# EAGLE design motor_controller (EAGLE 6.5.0)
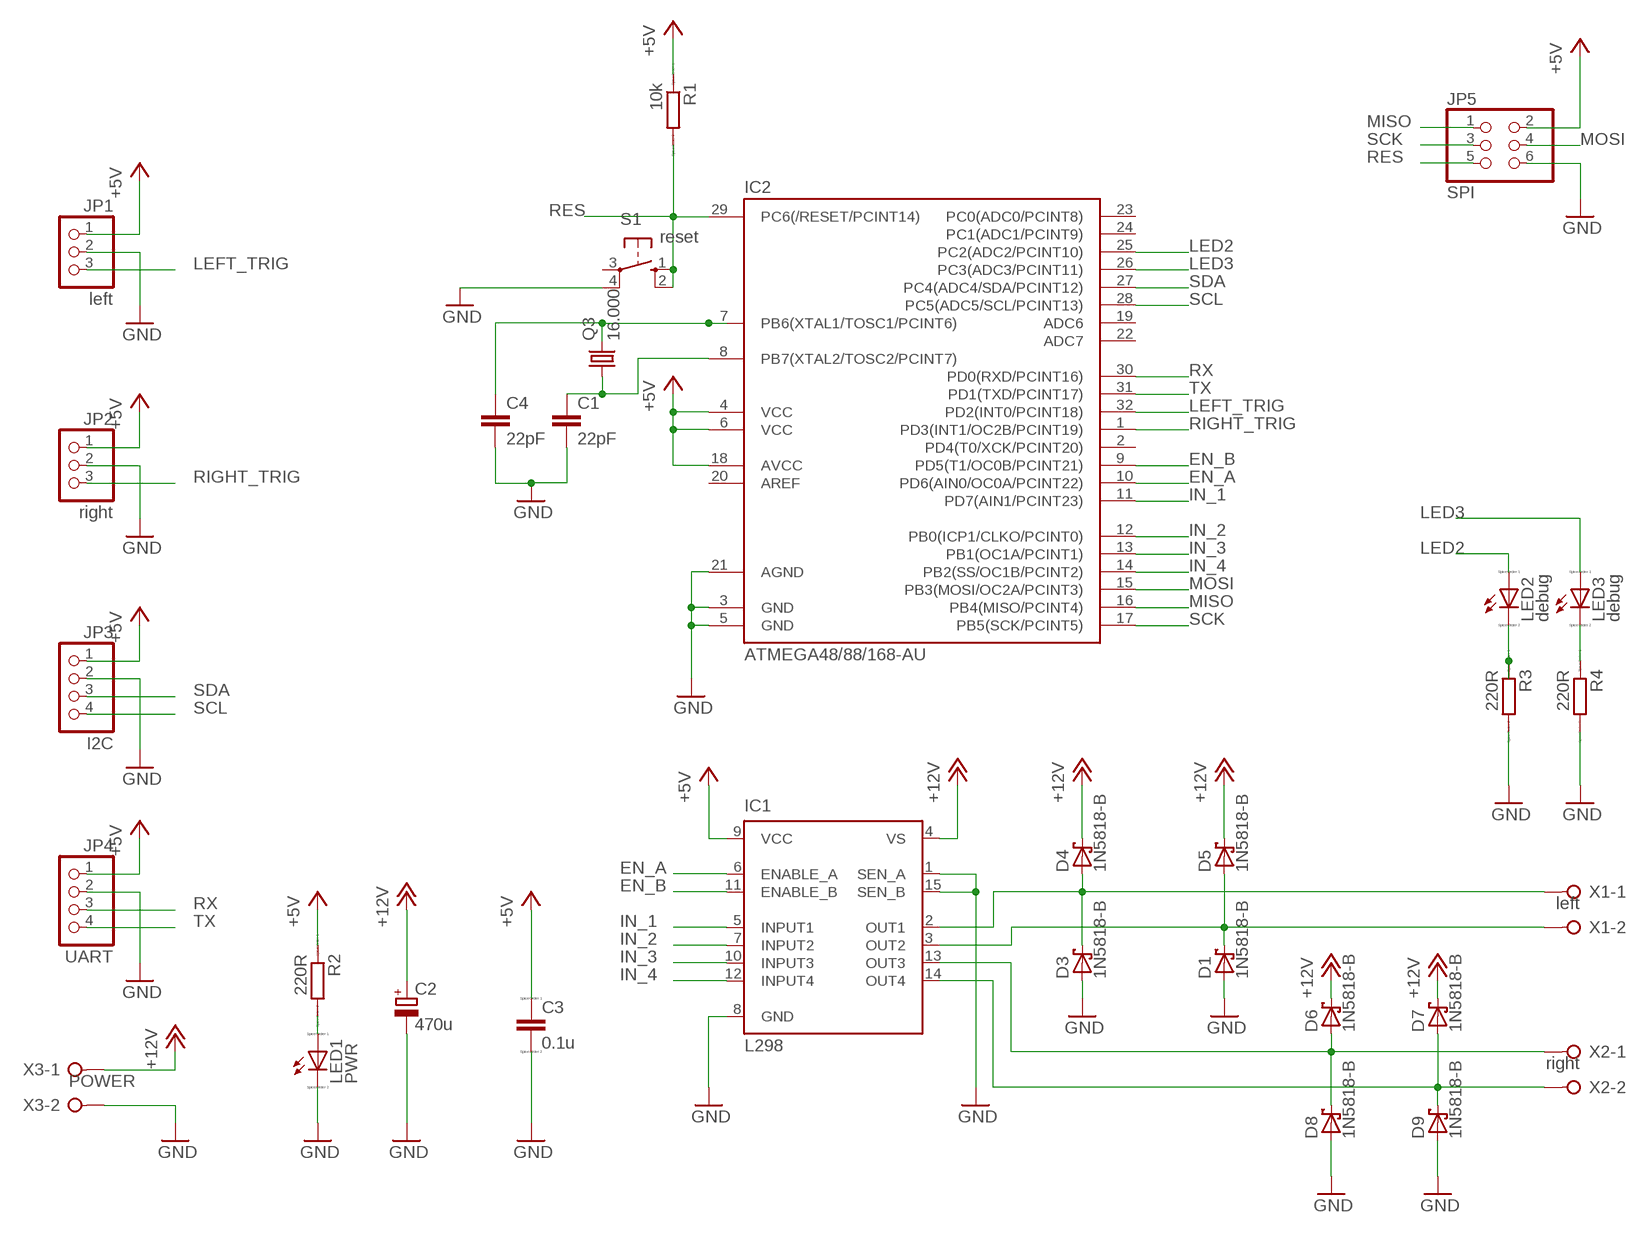
[diagram p0: schematic, sheet 1]

## Parts
C1  22pF  C-EUC0805  [C0805]
C2  470u  CPOL-EUE5-10.5  [E5-10,5]
C3  0.1u  C  [C0805]
C4  22pF  C-EUC0805  [C0805]
D1  1N5818-B  [DO41-7.6]
D3  1N5818-B  [DO41-7.6]
D4  1N5818-B  [DO41-7.6]
D5  1N5818-B  [DO41-7.6]
D6  1N5818-B  [DO41-7.6]
D7  1N5818-B  [DO41-7.6]
D8  1N5818-B  [DO41-7.6]
D9  1N5818-B  [DO41-7.6]
IC1  L298  [MULTIWATT-15]
IC2  ATMEGA48/88/168-AU  [TQFP32-08]
JP1  left  PINHD-1X3  [1X03]
JP2  right  PINHD-1X3  [1X03]
JP3  I2C  PINHD-1X4  [1X04]
JP4  UART  PINHD-1X4  [1X04]
JP5  SPI  PINHD-2X3  [2X03]
LED1  PWR  LED_E  [LED_1206]
LED2  debug  LED_E  [LED_1206]
LED3  debug  LED_E  [LED_1206]
Q3  16.000  CRYSTALHC49UP  [HC49UP]
R1  10k  R  [R0805]
R2  220R  R  [R0805]
R3  220R  R  [R0805]
R4  220R  R  [R0805]
S1  reset  10-XX  [B3F-10XX]
X1  left  W237-02P  [W237-132]
X2  right  W237-02P  [W237-132]
X3  POWER  W237-02P  [W237-132]

## Nets
+5V: C3.1 IC1.9(VCC) IC2.4(VCC) IC2.6(VCC) IC2.18(AVCC) JP1.1 JP2.1 JP3.1 JP4.1 JP5.2 R1.1 R2.1
+12V: C2.+ D4.C D5.C D6.C D7.C IC1.4(VS) X3.1
EN_A: IC1.6(ENABLE_A) IC2.10(PD6(AIN0/OC0A/PCINT22))
EN_B: IC1.11(ENABLE_B) IC2.9(PD5(T1/OC0B/PCINT21))
GND: C1.2 C2.- C3.2 C4.2 D1.A D3.A D8.A D9.A IC1.1(SEN_A) IC1.8(GND) IC1.15(SEN_B) IC2.3(GND) IC2.5(GND) IC2.21(AGND) JP1.2 JP2.2 JP3.2 JP4.2 JP5.6 LED1.C R3.2 R4.2 S1.4(P1) X3.2
IN_1: IC1.5(INPUT1) IC2.11(PD7(AIN1/PCINT23))
IN_2: IC1.7(INPUT2) IC2.12(PB0(ICP1/CLKO/PCINT0))
IN_3: IC1.10(INPUT3) IC2.13(PB1(OC1A/PCINT1))
IN_4: IC1.12(INPUT4) IC2.14(PB2(SS/OC1B/PCINT2))
LED2: IC2.25(PC2(ADC2/PCINT10)) LED2.A
LED3: IC2.26(PC3(ADC3/PCINT11)) LED3.A
LEFT_TRIG: IC2.32(PD2(INT0/PCINT18)) JP1.3
MISO: IC2.16(PB4(MISO/PCINT4)) JP5.1
MOSI: IC2.15(PB3(MOSI/OC2A/PCINT3)) JP5.4
N$1: LED1.A R2.2
N$2: C4.1 IC2.7(PB6(XTAL1/TOSC1/PCINT6)) Q3.2
N$3: C1.1 IC2.8(PB7(XTAL2/TOSC2/PCINT7)) Q3.1
N$4: LED3.C R4.1
N$5: LED2.C R3.1
N$7: D3.C D4.A IC1.2(OUT1) X1.1
N$8: D1.C D5.A IC1.3(OUT2) X1.2
N$9: D7.A D9.C IC1.14(OUT4) X2.2
N$10: D6.A D8.C IC1.13(OUT3) X2.1
RES: IC2.29(PC6(/RESET/PCINT14)) JP5.5 R1.2 S1.1(S) S1.2(S1)
RIGHT_TRIG: IC2.1(PD3(INT1/OC2B/PCINT19)) JP2.3
RX: IC2.30(PD0(RXD/PCINT16)) JP4.3
SCK: IC2.17(PB5(SCK/PCINT5)) JP5.3
SCL: IC2.28(PC5(ADC5/SCL/PCINT13)) JP3.4
SDA: IC2.27(PC4(ADC4/SDA/PCINT12)) JP3.3
TX: IC2.31(PD1(TXD/PCINT17)) JP4.4
Unconnected: IC2.2(PD4(T0/XCK/PCINT20)) IC2.19(ADC6) IC2.20(AREF) IC2.22(ADC7) IC2.23(PC0(ADC0/PCINT8)) IC2.24(PC1(ADC1/PCINT9)) S1.3(P)

## Library data of the parts
C1 C4 = rcl:C-EU: CAPACITOR, European symbol
C2 = rcl:CPOL-EU: POLARIZED CAPACITOR, European symbol
C3 = eagle-ltspice:C: CAPACITOR, European symbol; SPICEMODEL: NONE; SPICEPREFIX: C
D1 D3-D9 = diode:1N581*: 1.0A SCHOTTKY BARRIER RECTIFIER Source: http://www.diodes.com/datasheets/ds23001.pdf
IC1 = st-microelectronics:L298: DUAL FULL-BRIDGE DRIVER; MPN: L298N; OC_FARNELL: 1589425; OC_NEWARK: 32M1527
IC2 = atmega8:ATMEGA48/88/168
JP1 JP2 = pinhead:PINHD-1X3: PIN HEADER
JP3 JP4 = pinhead:PINHD-1X4: PIN HEADER
JP5 = pinhead:PINHD-2X3: PIN HEADER
LED1-LED3 = eagle-ltspice:LED_E: LED Source: http://www.osram.convergy.de Source: www.luxeon.com Source: www.kingbright.com; SPICEMODEL: NONE; SPICEPREFIX: D; SPICETYPE: diode
Q3 = crystal:CRYSTAL: CRYSTAL; OC_FARNELL: unknown; OC_NEWARK: unknown
R1-R4 = eagle-ltspice:R: RESISTOR, European symbol; SPICEMODEL: NONE; SPICEPREFIX: R
S1 = switch-omron:10-XX: OMRON SWITCH; MPN: B3F-1000; OC_FARNELL: 176432; OC_NEWARK: 36M3542
X1-X3 = con-wago-508:W237-02P: WAGO SREW CLAMP; OC_FARNELL: unknown; OC_NEWARK: unknown

## Board
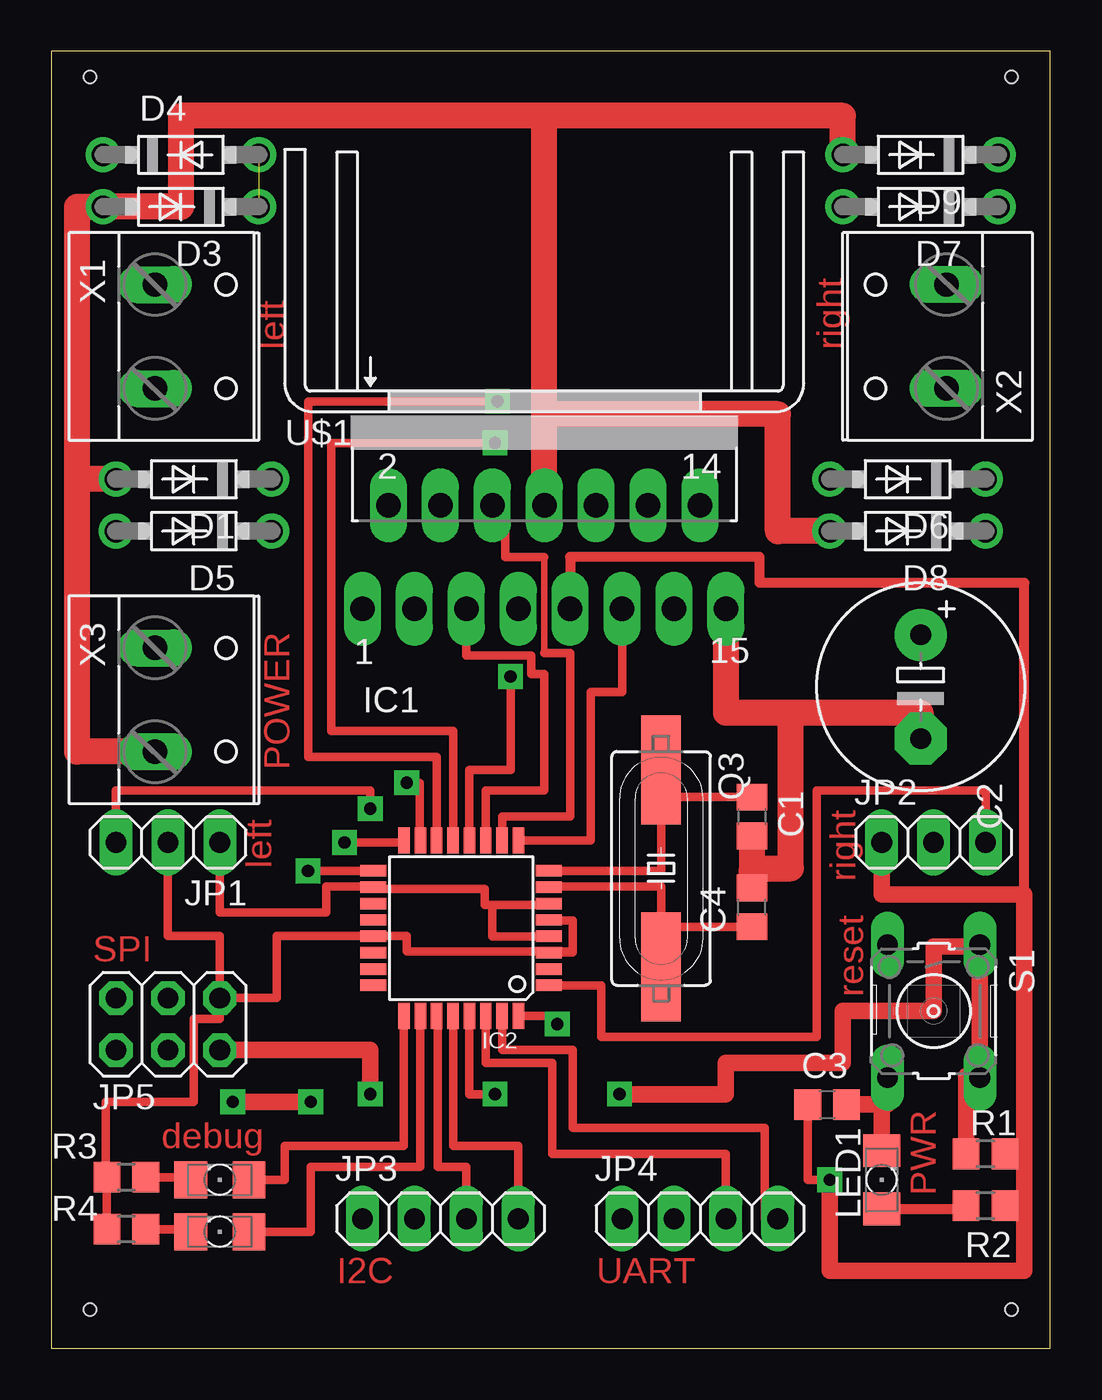
[diagram p1: board, top side]
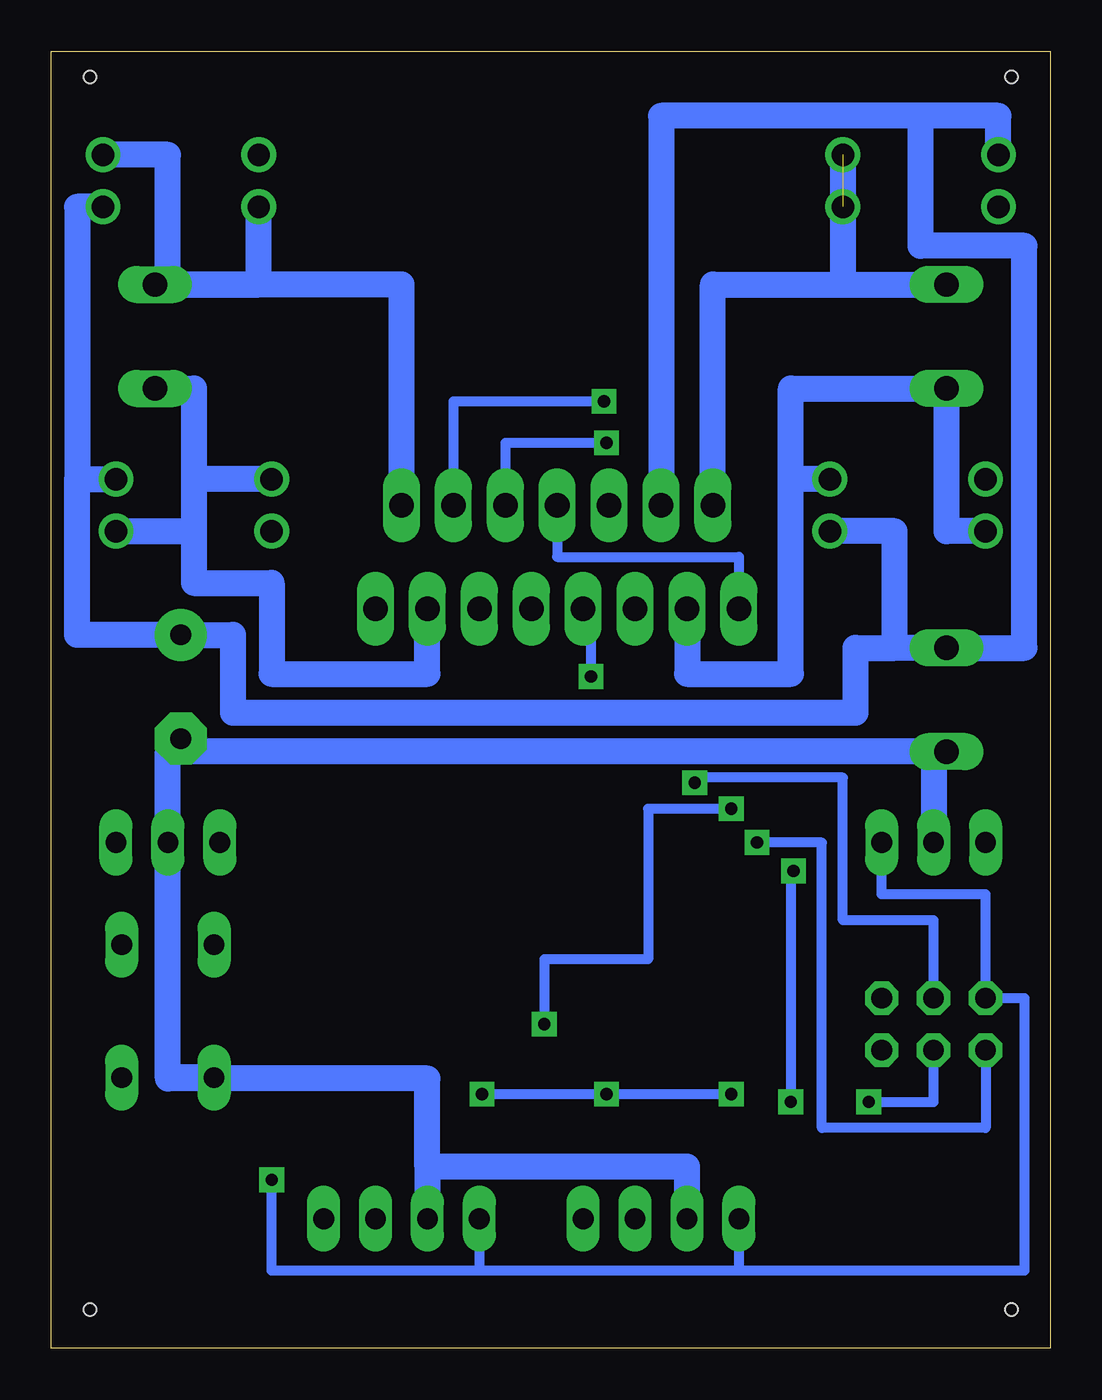
[diagram p2: board, bottom side, seen from below]

Size 48.9 x 63.5 mm. Coordinates in mm from the lower left corner, seen from the top.
Outline: 0,0 48.9,0 48.9,63.5 0,63.5 0,0
Copper layers (1*16): Top 0.035mm / dielectric 1.5mm / Bottom 0.035mm
Design rules "default": minimum track width 20mil, minimum drill 32mil, track to track 12mil, track to pad 12mil, pad to pad 12mil, via to via 12mil, smd to smd 8mil, copper to edge 40mil, drill to drill 40mil, minimum pad ring 12mil, minimum via ring 12mil, stop-mask expansion 4mil, vias tented up to drill 0mil, thermal gap 10mil
Holes 0.6 mm at 1.91,62.23 46.99,62.23 1.91,1.91 46.99,1.91

### Footprints (pad centres in the part's own frame; a part is rotated, then mirrored left to right if it is on the bottom)
C0805 = smd 1.3 x 1.5: 1 -0.95,0; 2 0.95,0
E5-10,5 = drill 1.016 pad 2.54: + -2.54,0 | drill 1.016 pad 2.54 octagon: - 2.54,0
DO41-7.6 = drill 1.1 pad 1.7: A 3.81,0; C -3.81,0
MULTIWATT-15 = drill 1.2 long: 1 -8.89,-7.62; 2 -7.62,-2.54; 3 -6.35,-7.62; 4 -5.08,-2.54; 5 -3.81,-7.62; 6 -2.54,-2.54; 7 -1.27,-7.62; 8 0,-2.54; 9 1.27,-7.62; 10 2.54,-2.54; 11 3.81,-7.62; 12 5.08,-2.54; 13 6.35,-7.62; 14 7.62,-2.54; 15 8.89,-7.62
TQFP32-08 = smd 1.27 x 0.559: 1 -4.293,2.8; 2 -4.293,2; 3 -4.293,1.2; 4 -4.293,0.4; 5 -4.293,-0.4; 6 -4.293,-1.2; 7 -4.293,-2; 8 -4.293,-2.8; 17 4.293,-2.8; 18 4.293,-2; 19 4.293,-1.2; 20 4.293,-0.4; 21 4.293,0.4; 22 4.293,1.2; 23 4.293,2; 24 4.293,2.8 | smd 0.559 x 1.27: 9 -2.8,-4.293; 10 -2,-4.293; 11 -1.2,-4.293; 12 -0.4,-4.293; 13 0.4,-4.293; 14 1.2,-4.293; 15 2,-4.293; 16 2.8,-4.293; 25 2.8,4.293; 26 2,4.293; 27 1.2,4.293; 28 0.4,4.293; 29 -0.4,4.293; 30 -1.2,4.293; 31 -2,4.293; 32 -2.8,4.293
1X03 = drill 1.016 long: 1 -2.54,0; 2 0,0; 3 2.54,0
1X04 = drill 1.016 long: 1 -3.81,0; 2 -1.27,0; 3 1.27,0; 4 3.81,0
2X03 = drill 1.016 octagon: 1 -2.54,-1.27; 2 -2.54,1.27; 3 0,-1.27; 4 0,1.27; 5 2.54,-1.27; 6 2.54,1.27
LED_1206 = smd 1.6 x 1.803: A -1.422,0; C 1.422,0
HC49UP = smd 5.334 x 1.93: 1 -4.826,0; 2 4.826,0
R0805 = smd 1.3 x 1.5: 1 -0.95,0; 2 0.95,0
B3F-10XX = drill 1.016 long: 1 -3.251,2.261; 2 3.251,2.261; 3 -3.251,-2.261; 4 3.251,-2.261
W237-132 = drill 1.194 long: 1 -2.54,-0.635; 2 2.54,-0.635

### Placement (x,y rotation side)
C1  34.29,26.04 270 top
C2  42.54,32.39 270 top
C3  37.97,11.94 0 top
C4  34.29,21.59 90 top
D1  6.98,42.55 180 top
D3  6.35,55.88 180 top
D4  6.35,58.42 0 top
D5  6.98,40 180 top
D6  41.91,42.55 180 top
D7  42.54,55.88 180 top
D8  41.91,40 180 top
D9  42.54,58.42 180 top
IC1  24.13,43.81 0 top
IC2  20.07,20.57 180 top
JP1  5.71,24.77 180 top
JP2  43.18,24.77 0 top
JP3  19.05,6.35 0 top
JP4  31.75,6.35 0 top
JP5  5.71,15.88 0 top
LED1  40.64,8.26 90 top
LED2  8.26,8.26 180 top
LED3  8.26,5.71 180 top
Q3  29.84,23.5 270 top
R1  45.72,9.53 180 top
R2  45.72,6.99 180 top
R3  3.68,8.38 180 top
R4  3.68,5.84 180 top
S1  43.18,16.51 270 top
U$1  [FK213]  24.13,46.86 0 top
X1  5.71,49.53 270 top
X2  43.18,49.53 90 top
X3  5.71,31.75 270 top

### Tracks (layer width: path | path; a pad name or v marks a point on that pad's centre or on a via)
+5V  (via drill 0.6)
  Top 0.406: IC2.6 24.36,21.72 21.59,21.72 | JP1.1 8.26,21.34 13.46,21.34 13.46,22.61 15.77,22.61 IC2.18 15.77,22.48 21.21,22.48 21.21,21.72 21.59,21.72 | IC2.4 21.59,20.17 21.59,21.72 | 37.47,12.07 37.02,12.07 C3.1 37.02,8.26 v38.1,8.26
  Top 0.5: 47.63,22.22 47.63,37.47 34.67,37.47 34.67,38.73 25.4,38.73 IC1.9
  Top 0.813: v38.1,8.26 38.1,3.81 47.63,3.81 47.63,6.99 | R2.1 47.63,6.99 | 47.63,6.99 47.63,9.53 | R1.1 47.63,9.53 | 47.63,9.53 47.63,22.22 40.64,22.22 JP2.1
  Bottom 0.5: 15.24,3.81 1.27,3.81 1.27,17.14 JP5.2 3.18,22.22 8.26,22.22 JP1.1 | 15.24,3.81 27.94,3.81 | 27.94,3.81 38.1,3.81 v38.1,8.26 | JP3.1 15.24,3.81 | JP4.1 27.94,3.81
+12V
  Bottom 1.27: D4.C 2.54,60.33 6.35,60.33 | 6.35,60.33 19.05,60.33 IC1.4 | 6.35,60.33 6.35,53.97 1.27,53.97 1.27,34.29 X3.1 7.62,34.29 | 7.62,34.29 7.62,40 D5.C | 7.62,34.29 9.52,34.29 9.52,31.11 40.01,31.11 40.01,34.92 C2.+ 47.63,34.92 47.63,42.55 | 47.63,42.55 D6.C | D7.C 47.63,55.88 47.63,42.55
EN_A
  Top 0.33: 24.13,38.73 24.13,34.04
  Top 0.406: IC1.6 22.23,41.28 22.23,38.73 24.13,38.73 | 24.13,34.04 25.4,34.04 25.4,26.04 22.07,26.04 IC2.10
EN_B
  Top 0.406: IC2.9 26.42,24.87 26.42,32.13 27.94,32.13 IC1.11
GND
  Top 0.406: JP5.6 11.05,17.14 11.05,20.19 15.77,20.19 | IC2.3 25.53,19.37 25.53,19.43 | IC2.5 24.36,20.96 25.53,20.96 25.53,19.43 | R3.2 2.67,8.51 2.67,12.07 6.98,12.07 6.98,16.13 8.26,16.13 JP5.6 | JP1.2 5.71,20.19 8.26,20.19 JP5.6 | 25.53,19.43 17.4,19.43 17.4,20.19 15.77,20.19 | 15.77,20.19 IC2.21 | 34.29,22.86 C4.2 | LED1.C 40.92,9.68 | 2.86,8.38 R3.2 | R3.2 R4.2
  Top 0.813: C3.2 40.64,11.94 | 40.64,11.94 40.92,11.94 S1.4 | LED1.C 40.64,11.94
  Top 1.27: IC1.8 24.13,45.72 | 24.13,45.72 24.13,60.33 | 24.13,60.33 6.35,60.33 6.35,55.88 D3.A 1.27,55.88 1.27,42.55 | D1.A 1.27,42.55 | D9.A 38.74,60.33 24.13,60.33 | X3.2 1.27,29.21 1.27,42.55 | D8.A 35.56,40 35.56,45.72 24.13,45.72 | IC1.15 33.02,31.11 36.2,31.11 | 36.2,31.11 42.54,31.11 C2.- | C1.2 34.29,23.5 | 34.29,22.86 34.29,23.5 | 34.29,23.5 36.2,23.5 36.2,31.11
  Bottom 0.5: IC1.8 24.13,38.73 15.24,38.73 IC1.1
  Bottom 1.27: 42.54,29.21 X3.2 5.71,29.21 JP1.2 | 42.54,29.21 C2.- | 42.54,29.21 43.18,29.21 JP2.2 43.18,13.26 | S1.4 43.18,13.26 | JP3.2 17.78,8.89 30.48,8.89 | 30.48,8.89 JP4.2 | 30.48,8.89 30.48,13.21 43.18,13.21 43.18,13.26
IN_1
  Top 0.406: IC1.5 20.32,33.91 23.5,33.91 23.5,33.02 24.13,33.02 24.13,27.31 21.27,27.31 IC2.11
IN_2  (via drill 0.6)
  Top 0.406: 20.45,24.87 IC2.12 20.47,28.32 22.48,28.32 v22.48,32.89
  Bottom 0.5: IC1.7 22.48,36.2 v22.48,32.89
IN_3  (via drill 0.6)
  Top 0.406: v21.72,44.32 13.72,44.32 13.72,30.23 19.67,30.23 IC2.13
  Bottom 0.5: v21.72,44.32 26.67,44.32 IC1.10
IN_4  (via drill 0.6)
  Top 0.406: v21.84,46.36 12.57,46.36 12.57,28.96 18.87,28.96 IC2.14
  Bottom 0.5: v21.84,46.36 29.21,46.36 IC1.12
LED2
  Top 0.406: IC2.25 17.27,9.91 11.43,9.91 11.43,8.26 LED2.A
LED3
  Top 0.406: IC2.26 18.07,8.89 12.7,8.89 12.7,5.71 LED3.A
LEFT_TRIG  (via drill 0.6)
  Top 0.406: JP1.3 3.18,27.31 15.62,27.31 v15.62,26.42 | IC2.32 24.77,16.28 v24.77,15.88
  Bottom 0.5: v15.62,26.42 19.69,26.42 19.69,19.05 24.77,19.05 v24.77,15.88
MISO  (via drill 0.6)
  Top 0.406: v14.35,24.77 17.27,24.77 IC2.16
  Bottom 0.5: JP5.1 3.18,10.8 11.18,10.8 11.18,24.77 v14.35,24.77
MOSI  (via drill 0.6)
  Top 0.406: IC2.15 18.03,24.87 18.03,27.69 v17.4,27.69
  Bottom 0.5: JP5.4 5.71,20.96 10.16,20.96 10.16,27.94 17.4,27.94 v17.4,27.69
N$1
  Top 0.5: LED1.A 44.77,6.83 R2.2
N$2
  Top 0.406: IC2.7 24.36,22.61 29.84,22.61 29.84,20.64 | Q3.2 29.84,20.32 29.84,20.64 | C4.1 29.84,20.64
N$3
  Top 0.406: IC2.8 29.84,23.37 29.84,26.99 | Q3.1 29.84,27.31 29.84,26.99 | C1.1 29.84,26.99
N$4
  Top 0.406: 6.33,5.33 LED3.C 6.83,5.84 R4.1
N$5
  Top 0.406: R3.1 6.83,8.38 LED2.C
N$7  (1 unrouted)
  Bottom 1.27: IC1.2 16.51,52.07 10.16,52.07 | 10.16,52.07 X1.1 | D4.A 10.16,52.07
N$8
  Bottom 0.406: 5.08,46.86 X1.2
  Bottom 1.27: IC1.3 17.78,33.02 12.7,33.02 12.7,42.55 | 12.7,42.55 12.7,46.99 X1.2 5.08,40 D5.A | D1.C 12.7,42.55
N$9
  Bottom 1.27: IC1.14 31.75,52.07 X2.2 | X2.2 38.74,52.07 D7.A | X2.2 43.18,52.07 43.18,58.42 D9.C
N$10
  Bottom 1.27: X2.1 41.91,46.99 41.91,42.55 | 41.91,42.55 41.91,40 | 41.91,40 41.91,37.47 38.1,37.47 38.1,33.02 30.48,33.02 IC1.13 | D6.A 41.91,42.55 | D8.C 41.91,40
RES  (via drill 0.6)
  Top 0.406: R1.2 44.45,9.4 | v21.72,12.45 20.47,12.45 IC2.29
  Top 0.813: JP5.5 15.62,14.61 v15.62,12.45 | v27.81,12.45 33.02,12.45 33.02,13.97 38.74,13.97 38.74,16.51 43.18,16.51 43.18,19.68 45.44,19.68 S1.1 45.44,13.34 | 45.44,13.34 S1.2 | 45.44,13.34 44.77,13.34 R1.2
  Bottom 0.5: v15.62,12.45 v21.72,12.45 v27.81,12.45
RIGHT_TRIG
  Top 0.406: JP2.3 45.72,27.31 37.47,27.31 37.47,15.24 26.92,15.24 26.92,17.78 IC2.1
RX
  Top 0.406: JP4.3 33.02,9.53 24.51,9.53 24.51,13.97 21.27,13.97 IC2.30
SCK  (via drill 0.6)
  Top 0.406: v12.57,23.37 IC2.17
  Top 0.813: v8.89,12.07 v12.7,12.07
  Bottom 0.406: v12.7,12.07 12.57,11.94
  Bottom 0.5: v12.57,23.37 12.7,23.37 v12.7,12.07 | v8.89,12.07 5.71,12.07 JP5.3
SCL
  Top 0.406: IC2.28 19.69,16.28 19.69,9.91 22.86,9.91 JP3.4
SDA
  Top 0.406: IC2.27 18.92,16.28 18.92,8.89 20.32,8.89 JP3.3
TX
  Top 0.406: JP4.4 34.93,6.35 34.93,10.8 25.53,10.8 25.53,14.61 22.07,14.61 IC2.31